# EAGLE schematic Z80Board (EAGLE 9.5.2)
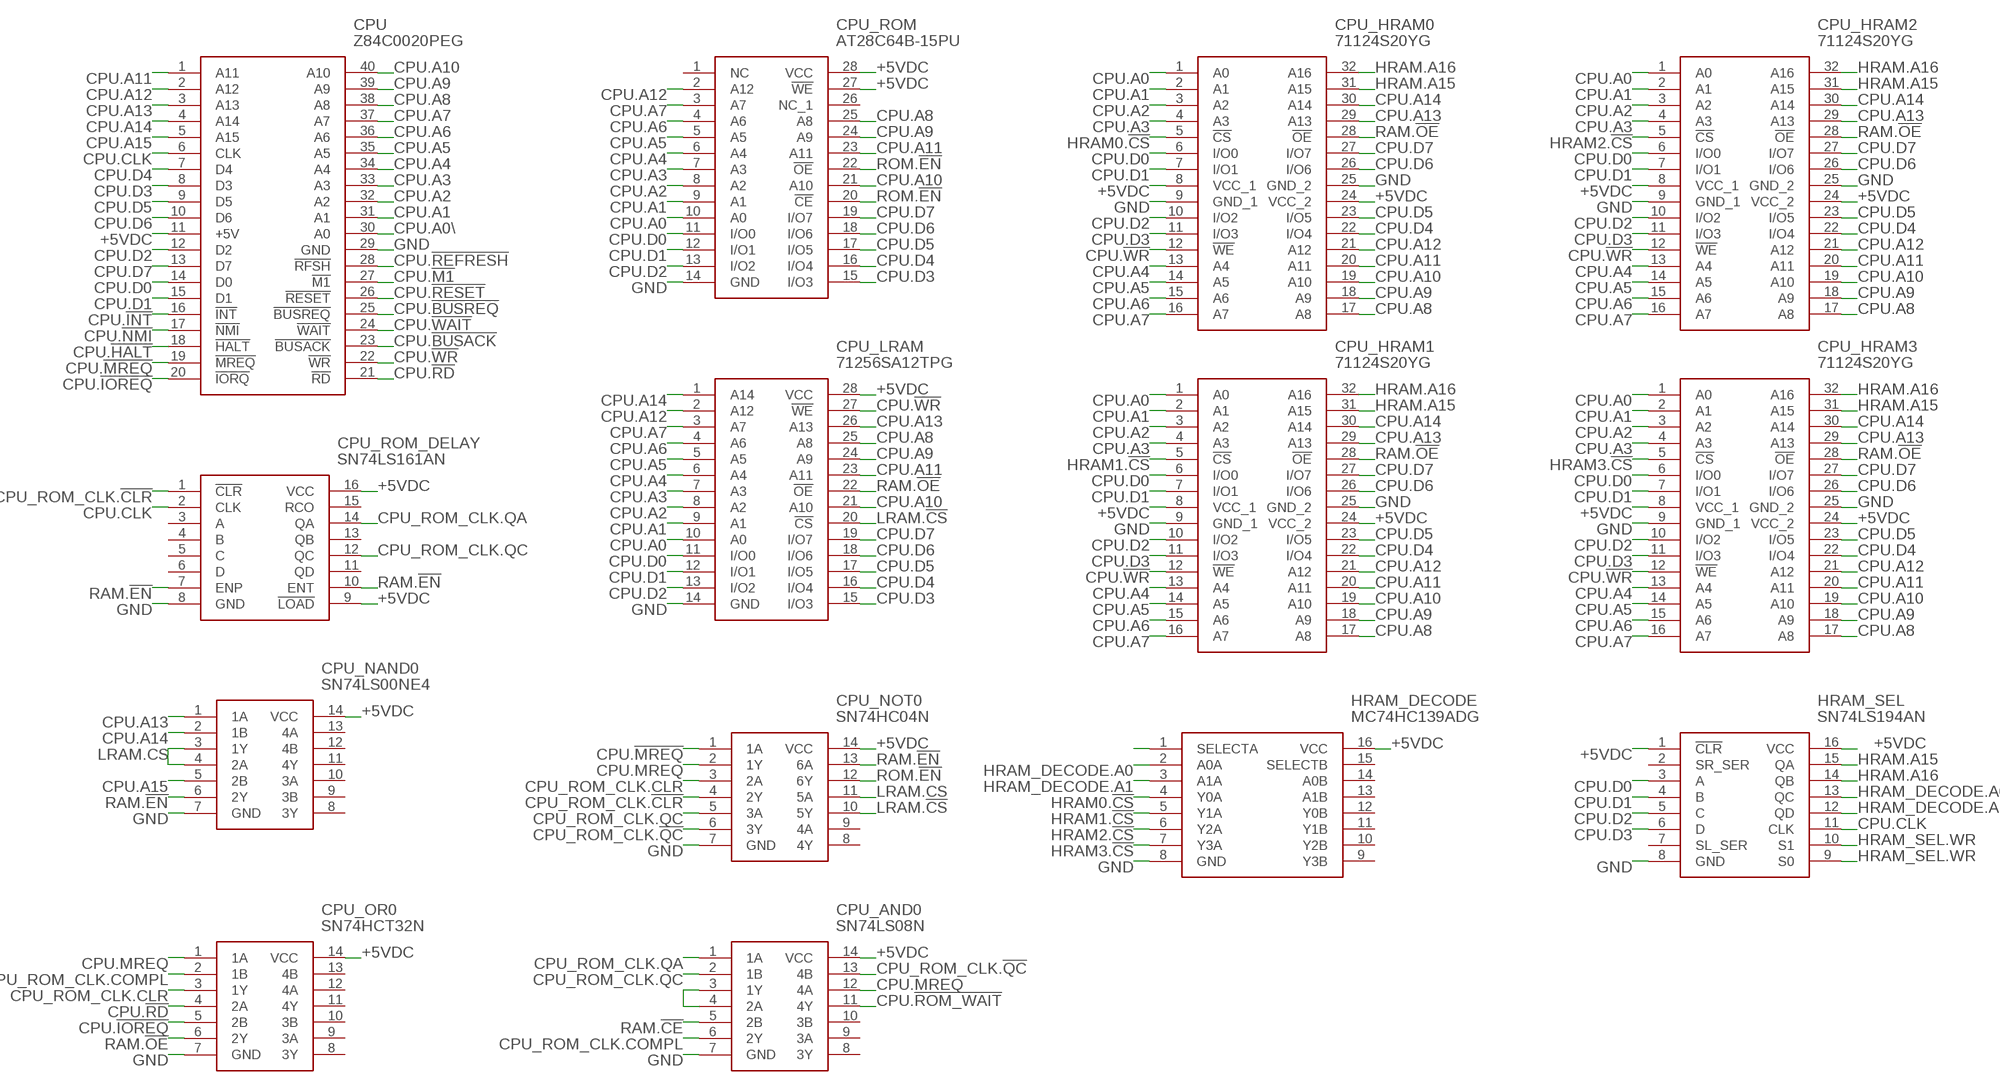
[diagram p0: schematic, sheet 1]

## Parts
CPU  Z84C0020PEG  [DIP1612W53P254L5232H406Q40N]
CPU_AND0  SN74LS08N  [DIP794W53P254L1930H508Q14N]
CPU_HRAM0  71124S20YG  [71124S20YG]
CPU_HRAM1  71124S20YG  [71124S20YG]
CPU_HRAM2  71124S20YG  [71124S20YG]
CPU_HRAM3  71124S20YG  [71124S20YG]
CPU_LRAM  71256SA12TPG  [DIP851W46P254L3556H330Q28N]
CPU_NAND0  SN74LS00NE4  [DIP794W53P254L1930H508Q14N]
CPU_NOT0  SN74HC04N  [DIP794W53P254L1930H508Q14N]
CPU_OR0  SN74HCT32N  [DIP794W53P254L1930H508Q14N]
CPU_ROM  AT28C64B-15PU  [DIP1556W56P254L3702H483Q28N]
CPU_ROM_DELAY  SN74LS161AN  [DIP794W53P254L1930H508Q16N]
HRAM_DECODE  MC74HC139ADG  [SOIC127P600X175-16N]
HRAM_SEL  SN74LS194AN  [DIP794W53P254L1930H508Q16N]

## Nets
+5VDC: CPU.11(+5V) CPU_AND0.14(VCC) CPU_HRAM0.8(VCC_1) CPU_HRAM0.24(VCC_2) CPU_HRAM1.8(VCC_1) CPU_HRAM1.24(VCC_2) CPU_HRAM2.8(VCC_1) CPU_HRAM2.24(VCC_2) CPU_HRAM3.8(VCC_1) CPU_HRAM3.24(VCC_2) CPU_LRAM.28(VCC) CPU_NAND0.14(VCC) CPU_NOT0.14(VCC) CPU_OR0.14(VCC) CPU_ROM.27(!WE) CPU_ROM.28(VCC) CPU_ROM_DELAY.9(!LOAD) CPU_ROM_DELAY.16(VCC) HRAM_DECODE.16(VCC) HRAM_SEL.1(!CLR) HRAM_SEL.16(VCC)
CPU.!BUSACK: CPU.23(!BUSACK)
CPU.!BUSREQ: CPU.25(!BUSREQ)
CPU.!HALT: CPU.18(!HALT)
CPU.!INT: CPU.16(!INT)
CPU.!IOREQ: CPU.20(!IORQ) CPU_OR0.5(2B)
CPU.!M1: CPU.27(!M1)
CPU.!MREQ: CPU.19(!MREQ) CPU_NOT0.1(1A)
CPU.!NMI: CPU.17(!NMI)
CPU.!RD: CPU.21(!RD) CPU_OR0.4(2A)
CPU.!REFRESH: CPU.28(!RFSH)
CPU.!RESET: CPU.26(!RESET)
CPU.!ROM_WAIT: CPU_AND0.11(4Y)
CPU.!WAIT: CPU.24(!WAIT)
CPU.!WR: CPU.22(!WR) CPU_HRAM0.12(!WE) CPU_HRAM1.12(!WE) CPU_HRAM2.12(!WE) CPU_HRAM3.12(!WE) CPU_LRAM.27(!WE)
CPU.A0: CPU_HRAM0.1(A0) CPU_HRAM1.1(A0) CPU_HRAM2.1(A0) CPU_HRAM3.1(A0) CPU_LRAM.10(A0) CPU_ROM.10(A0)
CPU.A0\: CPU.30(A0)
CPU.A1: CPU.31(A1) CPU_HRAM0.2(A1) CPU_HRAM1.2(A1) CPU_HRAM2.2(A1) CPU_HRAM3.2(A1) CPU_LRAM.9(A1) CPU_ROM.9(A1)
CPU.A2: CPU.32(A2) CPU_HRAM0.3(A2) CPU_HRAM1.3(A2) CPU_HRAM2.3(A2) CPU_HRAM3.3(A2) CPU_LRAM.8(A2) CPU_ROM.8(A2)
CPU.A3: CPU.33(A3) CPU_HRAM0.4(A3) CPU_HRAM1.4(A3) CPU_HRAM2.4(A3) CPU_HRAM3.4(A3) CPU_LRAM.7(A3) CPU_ROM.7(A3)
CPU.A4: CPU.34(A4) CPU_HRAM0.13(A4) CPU_HRAM1.13(A4) CPU_HRAM2.13(A4) CPU_HRAM3.13(A4) CPU_LRAM.6(A4) CPU_ROM.6(A4)
CPU.A5: CPU.35(A5) CPU_HRAM0.14(A5) CPU_HRAM1.14(A5) CPU_HRAM2.14(A5) CPU_HRAM3.14(A5) CPU_LRAM.5(A5) CPU_ROM.5(A5)
CPU.A6: CPU.36(A6) CPU_HRAM0.15(A6) CPU_HRAM1.15(A6) CPU_HRAM2.15(A6) CPU_HRAM3.15(A6) CPU_LRAM.4(A6) CPU_ROM.4(A6)
CPU.A7: CPU.37(A7) CPU_HRAM0.16(A7) CPU_HRAM1.16(A7) CPU_HRAM2.16(A7) CPU_HRAM3.16(A7) CPU_LRAM.3(A7) CPU_ROM.3(A7)
CPU.A8: CPU.38(A8) CPU_HRAM0.17(A8) CPU_HRAM1.17(A8) CPU_HRAM2.17(A8) CPU_HRAM3.17(A8) CPU_LRAM.25(A8) CPU_ROM.25(A8)
CPU.A9: CPU.39(A9) CPU_HRAM0.18(A9) CPU_HRAM1.18(A9) CPU_HRAM2.18(A9) CPU_HRAM3.18(A9) CPU_LRAM.24(A9) CPU_ROM.24(A9)
CPU.A10: CPU.40(A10) CPU_HRAM0.19(A10) CPU_HRAM1.19(A10) CPU_HRAM2.19(A10) CPU_HRAM3.19(A10) CPU_LRAM.21(A10) CPU_ROM.21(A10)
CPU.A11: CPU.1(A11) CPU_HRAM0.20(A11) CPU_HRAM1.20(A11) CPU_HRAM2.20(A11) CPU_HRAM3.20(A11) CPU_LRAM.23(A11) CPU_ROM.23(A11)
CPU.A12: CPU.2(A12) CPU_HRAM0.21(A12) CPU_HRAM1.21(A12) CPU_HRAM2.21(A12) CPU_HRAM3.21(A12) CPU_LRAM.2(A12) CPU_ROM.2(A12)
CPU.A13: CPU.3(A13) CPU_HRAM0.29(A13) CPU_HRAM1.29(A13) CPU_HRAM2.29(A13) CPU_HRAM3.29(A13) CPU_LRAM.26(A13) CPU_NAND0.1(1A)
CPU.A14: CPU.4(A14) CPU_HRAM0.30(A14) CPU_HRAM1.30(A14) CPU_HRAM2.30(A14) CPU_HRAM3.30(A14) CPU_LRAM.1(A14) CPU_NAND0.2(1B)
CPU.A15: CPU.5(A15) CPU_NAND0.5(2B)
CPU.CLK: CPU.6(CLK) CPU_ROM_DELAY.2(CLK) HRAM_SEL.11(CLK)
CPU.D0: CPU.14(D0) CPU_HRAM0.6(I/O0) CPU_HRAM1.6(I/O0) CPU_HRAM2.6(I/O0) CPU_HRAM3.6(I/O0) CPU_LRAM.11(I/O0) CPU_ROM.11(I/O0) HRAM_SEL.3(A)
CPU.D1: CPU.15(D1) CPU_HRAM0.7(I/O1) CPU_HRAM1.7(I/O1) CPU_HRAM2.7(I/O1) CPU_HRAM3.7(I/O1) CPU_LRAM.12(I/O1) CPU_ROM.12(I/O1) HRAM_SEL.4(B)
CPU.D2: CPU.12(D2) CPU_HRAM0.10(I/O2) CPU_HRAM1.10(I/O2) CPU_HRAM2.10(I/O2) CPU_HRAM3.10(I/O2) CPU_LRAM.13(I/O2) CPU_ROM.13(I/O2) HRAM_SEL.5(C)
CPU.D3: CPU.8(D3) CPU_HRAM0.11(I/O3) CPU_HRAM1.11(I/O3) CPU_HRAM2.11(I/O3) CPU_HRAM3.11(I/O3) CPU_LRAM.15(I/O3) CPU_ROM.15(I/O3) HRAM_SEL.6(D)
CPU.D4: CPU.7(D4) CPU_HRAM0.22(I/O4) CPU_HRAM1.22(I/O4) CPU_HRAM2.22(I/O4) CPU_HRAM3.22(I/O4) CPU_LRAM.16(I/O4) CPU_ROM.16(I/O4)
CPU.D5: CPU.9(D5) CPU_HRAM0.23(I/O5) CPU_HRAM1.23(I/O5) CPU_HRAM2.23(I/O5) CPU_HRAM3.23(I/O5) CPU_LRAM.17(I/O5) CPU_ROM.17(I/O5)
CPU.D6: CPU.10(D6) CPU_HRAM0.26(I/O6) CPU_HRAM1.26(I/O6) CPU_HRAM2.26(I/O6) CPU_HRAM3.26(I/O6) CPU_LRAM.18(I/O6) CPU_ROM.18(I/O6)
CPU.D7: CPU.13(D7) CPU_HRAM0.27(I/O7) CPU_HRAM1.27(I/O7) CPU_HRAM2.27(I/O7) CPU_HRAM3.27(I/O7) CPU_LRAM.19(I/O7) CPU_ROM.19(I/O7)
CPU.MREQ: CPU_AND0.12(4A) CPU_NOT0.2(1Y) CPU_OR0.1(1A)
CPU_ROM_CLK.!CLR: CPU_NOT0.4(2Y) CPU_ROM_DELAY.1(!CLR)
CPU_ROM_CLK.!QC: CPU_AND0.13(4B) CPU_NOT0.6(3Y)
CPU_ROM_CLK.CLR: CPU_NOT0.3(2A) CPU_OR0.3(1Y)
CPU_ROM_CLK.COMPL: CPU_AND0.6(2Y) CPU_OR0.2(1B)
CPU_ROM_CLK.QA: CPU_AND0.1(1A) CPU_ROM_DELAY.14(QA)
CPU_ROM_CLK.QC: CPU_AND0.2(1B) CPU_NOT0.5(3A) CPU_ROM_DELAY.12(QC)
GND: CPU.29(GND) CPU_AND0.7(GND) CPU_HRAM0.9(GND_1) CPU_HRAM0.25(GND_2) CPU_HRAM1.9(GND_1) CPU_HRAM1.25(GND_2) CPU_HRAM2.9(GND_1) CPU_HRAM2.25(GND_2) CPU_HRAM3.9(GND_1) CPU_HRAM3.25(GND_2) CPU_LRAM.14(GND) CPU_NAND0.7(GND) CPU_NOT0.7(GND) CPU_OR0.7(GND) CPU_ROM.14(GND) CPU_ROM_DELAY.8(GND) HRAM_DECODE.8(GND) HRAM_SEL.8(GND)
HRAM0.!CS: CPU_HRAM0.5(!CS) HRAM_DECODE.4(Y0A)
HRAM1.!CS: CPU_HRAM1.5(!CS) HRAM_DECODE.5(Y1A)
HRAM2.!CS: CPU_HRAM2.5(!CS) HRAM_DECODE.6(Y2A)
HRAM3.!CS: CPU_HRAM3.5(!CS) HRAM_DECODE.7(Y3A)
HRAM.A15: CPU_HRAM0.31(A15) CPU_HRAM1.31(A15) CPU_HRAM2.31(A15) CPU_HRAM3.31(A15) HRAM_SEL.15(QA)
HRAM.A16: CPU_HRAM0.32(A16) CPU_HRAM1.32(A16) CPU_HRAM2.32(A16) CPU_HRAM3.32(A16) HRAM_SEL.14(QB)
HRAM_DECODE.A0: HRAM_DECODE.2(A0A) HRAM_SEL.13(QC)
HRAM_DECODE.A1: HRAM_DECODE.3(A1A) HRAM_SEL.12(QD)
HRAM_SEL.WR: HRAM_SEL.9(S0) HRAM_SEL.10(S1)
LRAM.!CS: CPU_LRAM.20(!CS) CPU_NOT0.10(5Y)
LRAM.CS: CPU_NAND0.3(1Y) CPU_NAND0.4(2A) CPU_NOT0.11(5A)
N$4: CPU_AND0.3(1Y) CPU_AND0.4(2A)
N$50: HRAM_DECODE.1(SELECTA)
RAM.!CE: CPU_AND0.5(2B)
RAM.!EN: CPU_NAND0.6(2Y) CPU_NOT0.13(6A) CPU_ROM_DELAY.7(ENP) CPU_ROM_DELAY.10(ENT)
RAM.!OE: CPU_HRAM0.28(!OE) CPU_HRAM1.28(!OE) CPU_HRAM2.28(!OE) CPU_HRAM3.28(!OE) CPU_LRAM.22(!OE) CPU_OR0.6(2Y)
ROM.!EN: CPU_NOT0.12(6Y) CPU_ROM.20(!CE) CPU_ROM.22(!OE)
Unconnected: CPU_AND0.8(3Y) CPU_AND0.9(3A) CPU_AND0.10(3B) CPU_NAND0.8(3Y) CPU_NAND0.9(3B) CPU_NAND0.10(3A) CPU_NAND0.11(4Y) CPU_NAND0.12(4B) CPU_NAND0.13(4A) CPU_NOT0.8(4Y) CPU_NOT0.9(4A) CPU_OR0.8(3Y) CPU_OR0.9(3A) CPU_OR0.10(3B) CPU_OR0.11(4Y) CPU_OR0.12(4A) CPU_OR0.13(4B) CPU_ROM.1(NC) CPU_ROM.26(NC_1) CPU_ROM_DELAY.3(A) CPU_ROM_DELAY.4(B) CPU_ROM_DELAY.5(C) CPU_ROM_DELAY.6(D) CPU_ROM_DELAY.11(QD) CPU_ROM_DELAY.13(QB) CPU_ROM_DELAY.15(RCO) HRAM_DECODE.9(Y3B) HRAM_DECODE.10(Y2B) HRAM_DECODE.11(Y1B) HRAM_DECODE.12(Y0B) HRAM_DECODE.13(A1B) HRAM_DECODE.14(A0B) HRAM_DECODE.15(SELECTB) HRAM_SEL.2(SR_SER) HRAM_SEL.7(SL_SER)

## Library data of the parts
CPU = SamacSys_Parts:Z84C0020PEG: Microprocessors - MPU 20MHz CMOS CPU XTEMP Source: Datasheet <https://eagle.componentsearchengine.com/Datasheets/1/Z84C0020PEG.pdf>; DESCRIPTION: Microprocessors - MPU 20MHz CMOS CPU XTEMP; HEIGHT: 4.06mm; MANUFACTURER_NAME: Zilog; MANUFACTURER_PART_NUMBER: Z84C0020PEG
CPU_AND0 = SamacSys_Parts:SN74LS08N: Quad 2i/p AND gate,SN74LS08N DIP14 25pcs Source: Datasheet <http://componentsearchengine.com/Datasheets/3/SN74LS08N.pdf>; DESCRIPTION: Quad 2i/p AND gate,SN74LS08N DIP14 25pcs; HEIGHT: 5.08mm; MANUFACTURER_NAME: Texas Instruments; MANUFACTURER_PART_NUMBER: SN74LS08N; MOUSER_PART_NUMBER: 595-SN74LS08N; MOUSER_PRICE-STOCK: https://www.mouser.com/Search/Refine.aspx?Keyword=595-SN74LS08N; RS_PART_NUMBER: 0307519P; RS_PRICE-STOCK: http://uk.rs-online.com/web/p/products/0307519P
CPU_HRAM0 CPU_HRAM1-CPU_HRAM3 = SamacSys_Parts:71124S20YG: SOIC 400 MIL J-BEND Source: Datasheet <https://www.idt.com/document/dst/71124-data-sheet>; DESCRIPTION: SOIC 400 MIL J-BEND; HEIGHT: 3.683mm; MANUFACTURER_NAME: IDT; MANUFACTURER_PART_NUMBER: 71124S20YG; MOUSER_PART_NUMBER: 972-71124S20YG; MOUSER_PRICE-STOCK: https://www.mouser.com/Search/Refine.aspx?Keyword=972-71124S20YG
CPU_LRAM = SamacSys_Parts:71256SA12TPG: SRAM 32Kx8 ASYNCHRONOUS 5.0V STATIC RAM Source: Datasheet <https://eagle.componentsearchengine.com/Datasheets/1/71256SA12TPG.pdf>; DESCRIPTION: SRAM 32Kx8 ASYNCHRONOUS 5.0V STATIC RAM; HEIGHT: 3.302mm; MANUFACTURER_NAME: Renesas / IDT; MANUFACTURER_PART_NUMBER: 71256SA12TPG
CPU_NAND0 = SamacSys_Parts:SN74LS00NE4: Logic Gates Quad 2-Input Positive-NAND gates Source: Datasheet <http://www.ti.com/general/docs/lit/getliterature.tsp?genericPartNumber=SN74LS00&&fileType=pdf>; DESCRIPTION: Logic Gates Quad 2-Input Positive-NAND gates; HEIGHT: 5.08mm; MANUFACTURER_NAME: Texas Instruments; MANUFACTURER_PART_NUMBER: SN74LS00NE4; MOUSER_PART_NUMBER: 595-SN74LS00NE4; MOUSER_PRICE-STOCK: https://www.mouser.com/Search/Refine.aspx?Keyword=595-SN74LS00NE4
CPU_NOT0 = SamacSys_Parts:SN74HC04N: Hex inverter,SN74HC04N DIP14 2.6V 25pcs Source: Datasheet <http://www.ti.com/lit/gpn/sn74hc04>; DESCRIPTION: Hex inverter,SN74HC04N DIP14 2.6V 25pcs; HEIGHT: 5.08mm; MANUFACTURER_NAME: Texas Instruments; MANUFACTURER_PART_NUMBER: SN74HC04N; MOUSER_PART_NUMBER: 595-SN74HC04N; MOUSER_PRICE-STOCK: https://www.mouser.com/Search/Refine.aspx?Keyword=595-SN74HC04N; RS_PART_NUMBER: 2175550P; RS_PRICE-STOCK: http://uk.rs-online.com/web/p/products/2175550P
CPU_OR0 = SamacSys_Parts:SN74HCT32N: Quad 2i/p ORgate,SN74HCT32N DIP14 4.5-5V Source: Datasheet <http://www.ti.com/lit/gpn/sn74hct32>; DESCRIPTION: Quad 2i/p ORgate,SN74HCT32N DIP14 4.5-5V; HEIGHT: 5.08mm; MANUFACTURER_NAME: Texas Instruments; MANUFACTURER_PART_NUMBER: SN74HCT32N; MOUSER_PART_NUMBER: 595-SN74HCT32N; MOUSER_PRICE-STOCK: https://www.mouser.com/Search/Refine.aspx?Keyword=595-SN74HCT32N; RS_PART_NUMBER: 2175768P; RS_PRICE-STOCK: http://uk.rs-online.com/web/p/products/2175768P
CPU_ROM = SamacSys_Parts:AT28C64B-15PU: AT28C64B-15PU, Parallel EEPROM Memory 64kbit, Parallel, 150ns 4.5 5.5 V, 28-Pin PDIP Source: Datasheet <http://www.atmel.com/images/doc0270.pdf>; DESCRIPTION: AT28C64B-15PU, Parallel EEPROM Memory 64kbit, Parallel, 150ns 4.5 5.5 V, 28-Pin PDIP; HEIGHT: 4.826mm; MANUFACTURER_NAME: Microchip; MANUFACTURER_PART_NUMBER: AT28C64B-15PU; MOUSER_PART_NUMBER: 556-AT28C64B15PU; MOUSER_PRICE-STOCK: https://www.mouser.com/Search/Refine.aspx?Keyword=556-AT28C64B15PU; RS_PART_NUMBER: 2509609978; RS_PRICE-STOCK: http://uk.rs-online.com/web/p/products/2509609978
CPU_ROM_DELAY = SamacSys_Parts:SN74LS161AN: Synchronous 4-Bit Binary Counters Source: Datasheet <http://www.ti.com/lit/gpn/sn74ls161a>; DESCRIPTION: Synchronous 4-Bit Binary Counters; HEIGHT: 5.08mm; MANUFACTURER_NAME: Texas Instruments; MANUFACTURER_PART_NUMBER: SN74LS161AN; MOUSER_PART_NUMBER: 595-SN74LS161AN; MOUSER_PRICE-STOCK: https://www.mouser.com/Search/Refine.aspx?Keyword=595-SN74LS161AN
HRAM_DECODE = SamacSys_Parts:MC74HC139ADG: ON Semiconductor MC74HC139ADG, Dual, Decoder, Demultiplexer, 1-of-4, Inverting, 2 6 V, 16-Pin SOIC Source: Datasheet <http://www.onsemi.com/pub/Collateral/MC74HC139A-D.PDF>; DESCRIPTION: ON Semiconductor MC74HC139ADG, Dual, Decoder, Demultiplexer, 1-of-4, Inverting, 2 6 V, 16-Pin SOIC; HEIGHT: 1.75mm; MANUFACTURER_NAME: ON Semiconductor; MANUFACTURER_PART_NUMBER: MC74HC139ADG; MOUSER_PART_NUMBER: 863-MC74HC139ADG; MOUSER_PRICE-STOCK: https://www.mouser.com/Search/Refine.aspx?Keyword=863-MC74HC139ADG; RS_PART_NUMBER: 8061416P; RS_PRICE-STOCK: http://uk.rs-online.com/web/p/products/8061416P
HRAM_SEL = SamacSys_Parts:SN74LS194AN: 4b univ shift register,SN74LS194AN 25pcs Source: Datasheet <http://www.ti.com/lit/gpn/SN74LS194A>; DESCRIPTION: 4b univ shift register,SN74LS194AN 25pcs; HEIGHT: 5.08mm; MANUFACTURER_NAME: Texas Instruments; MANUFACTURER_PART_NUMBER: SN74LS194AN